# Altium schematic sheet OSPLC2_2_CPU3.SchDoc
size 294 x 198 mm
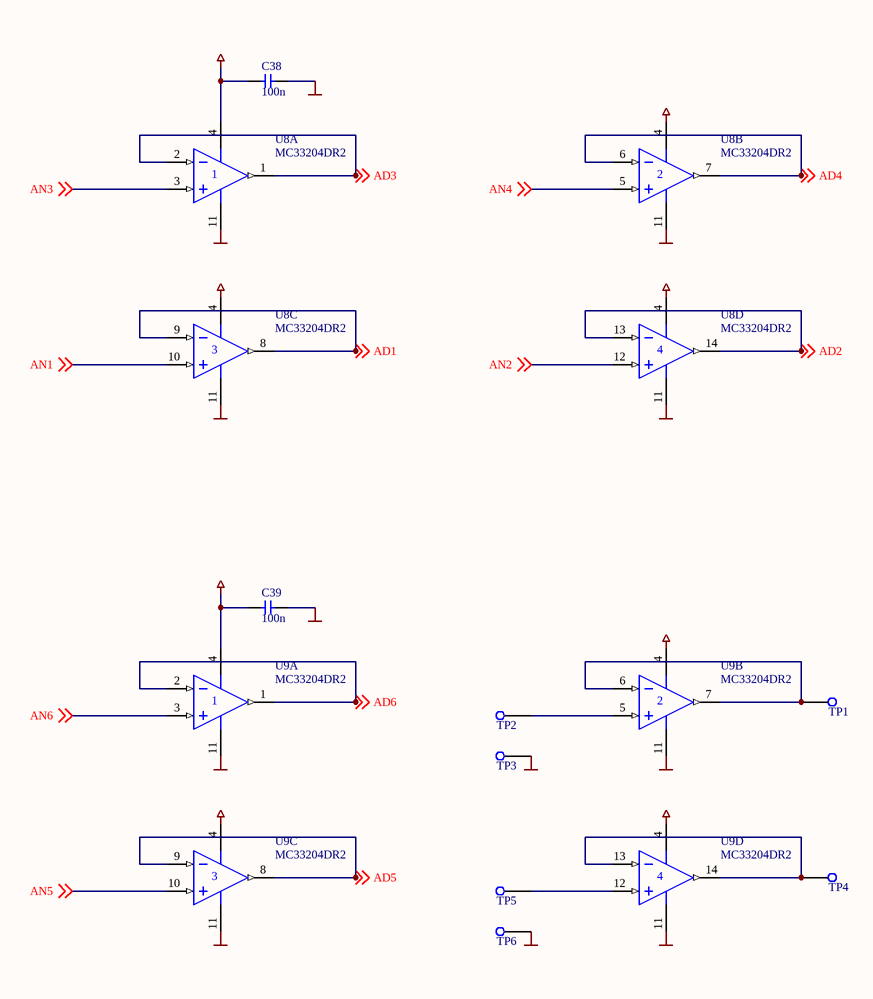
[diagram p0: OSPLC2_2_CPU3.SchDoc]

## Parts
C38  value 100n  [0603]  (hidden comment: 0603)
C39  value 100n  [0603]  (hidden comment: 0603)
TP1  TEST POINT  [TEST_POINT_TH]  (value not drawn)
TP2  TEST POINT  [TEST_POINT_TH]  (value not drawn)
TP3  TEST POINT  [TEST_POINT_TH]  (value not drawn)
TP4  TEST POINT  [TEST_POINT_TH]  (value not drawn)
TP5  TEST POINT  [TEST_POINT_TH]  (value not drawn)
TP6  TEST POINT  [TEST_POINT_TH]  (value not drawn)
U8  MC33204DR2  [SO-G14]  (parts A,B,C,D of 4)
U9  MC33204DR2  [SO-G14]  (parts A,B,C,D of 4)

## Nets
GND: C38.2 C39.2 TP3.1 TP6.1 U8.11(V-) U9.11(V-)
VCC3v3: C38.1 C39.1 U8.4(V+) U9.4(V+)
AD1: U8.8(OUT) U8.9(IN-) ; off-sheet AD1
AD2: U8.13(IN-) U8.14(OUT) ; off-sheet AD2
AD3: U8.1(OUT) U8.2(IN-) ; off-sheet AD3
AD4: U8.6(IN-) U8.7(OUT) ; off-sheet AD4
AD5: U9.8(OUT) U9.9(IN-) ; off-sheet AD5
AD6: U9.1(OUT) U9.2(IN-) ; off-sheet AD6
AN1: U8.10(IN+) ; off-sheet AN1
AN2: U8.12(IN+) ; off-sheet AN2
AN3: U8.3(IN+) ; off-sheet AN3
AN4: U8.5(IN+) ; off-sheet AN4
AN5: U9.10(IN+) ; off-sheet AN5
AN6: U9.3(IN+) ; off-sheet AN6
NetTP1_1: TP1.1 U9.6(IN-) U9.7(OUT)
NetTP2_1: TP2.1 U9.5(IN+)
NetTP4_1: TP4.1 U9.13(IN-) U9.14(OUT)
NetTP5_1: TP5.1 U9.12(IN+)

## Library data of the parts
C38 C39 = CAP_0603: 0603 footprint non-polorised capacitor
TP1-TP6 = TEST_POINT_TH: Through hole test point
U8 U9 = MC33204DR2: Rail-to-Rail Quad Operational Amplifier; Manufacturer: Motorola; Package Information: Latest Revision: May-1997; Published: 15-Apr-2002; Revision: 23-Sep-2002: SIM Model Added.; Datasheet: Latest Revision: Nov-1999; Package Reference: 751A-03; Publisher: Altium Limited; Class I: Amplifier; Class II: Operational Amplifier